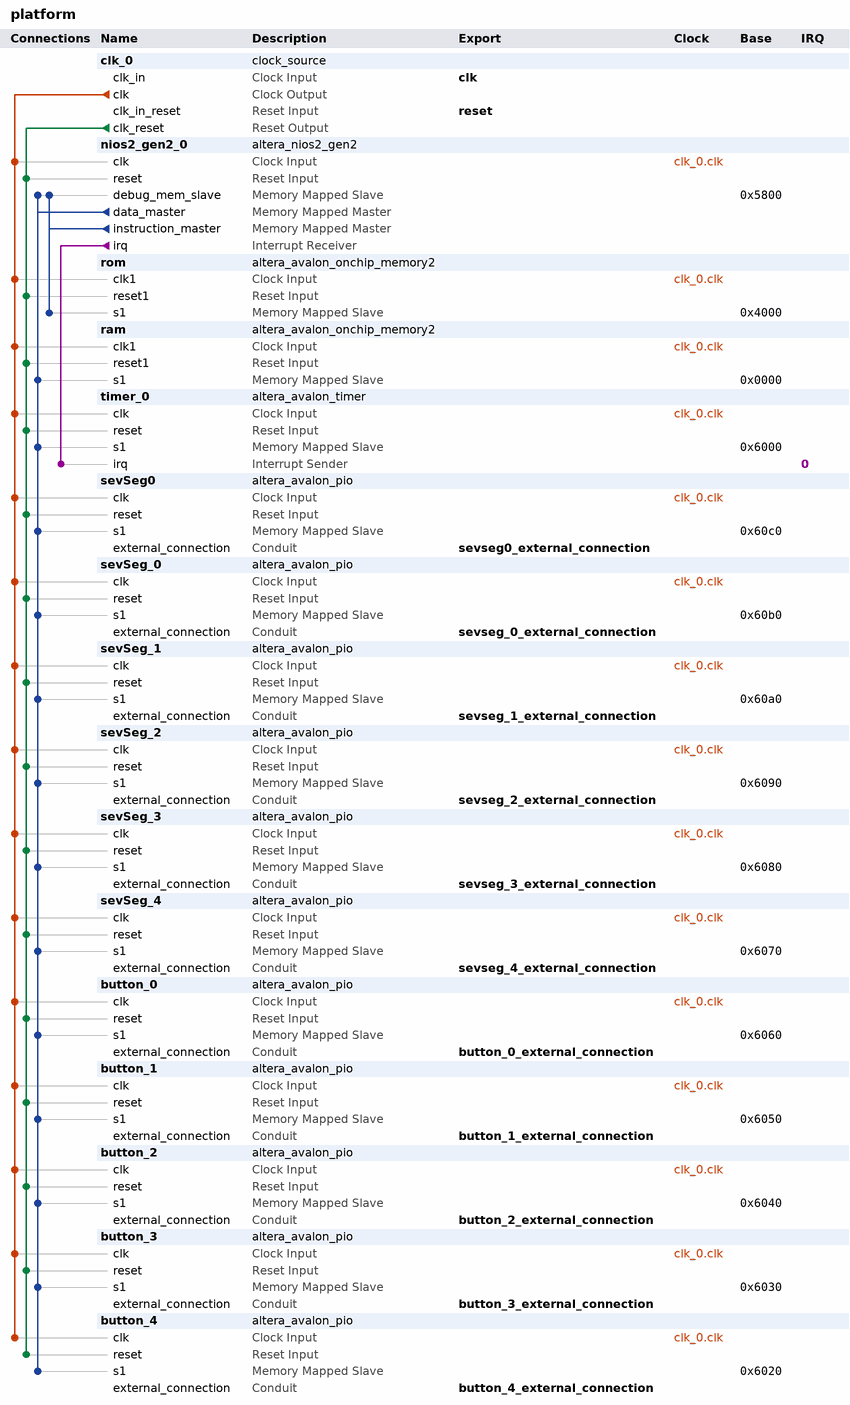
[diagram p0: system contents]
# Platform Designer (Qsys) system platform, Cyclone V 5CSEMA5F31C6
# Parameters at their usual value, and those the tool derives, are not listed.
package require -exact qsys 17.1
create_system platform
set_project_property DEVICE_FAMILY {Cyclone V}
set_project_property DEVICE 5CSEMA5F31C6

add_instance clk_0 clock_source 17.1
set_instance_parameter_value clk_0 clockFrequency 50000000

add_instance nios2_gen2_0 altera_nios2_gen2 17.1
set_instance_parameter_value nios2_gen2_0 dcache_size 2048
set_instance_parameter_value nios2_gen2_0 exceptionSlave rom.s1
set_instance_parameter_value nios2_gen2_0 icache_size 4096
set_instance_parameter_value nios2_gen2_0 impl Tiny
set_instance_parameter_value nios2_gen2_0 resetSlave rom.s1

add_instance rom altera_avalon_onchip_memory2 17.1
set_instance_parameter_value rom dataWidth 32
set_instance_parameter_value rom dualPort false
set_instance_parameter_value rom initMemContent true
set_instance_parameter_value rom initializationFileName onchip_mem.hex
set_instance_parameter_value rom memorySize 4096
set_instance_parameter_value rom writable false

add_instance ram altera_avalon_onchip_memory2 17.1
set_instance_parameter_value ram dataWidth 32
set_instance_parameter_value ram dualPort false
set_instance_parameter_value ram initMemContent true
set_instance_parameter_value ram initializationFileName onchip_mem.hex
set_instance_parameter_value ram memorySize 16384

add_instance timer_0 altera_avalon_timer 17.1
set_instance_parameter_value timer_0 alwaysRun true
set_instance_parameter_value timer_0 fixedPeriod true
set_instance_parameter_value timer_0 period 1
set_instance_parameter_value timer_0 periodUnits SEC
set_instance_parameter_value timer_0 snapshot false

add_instance sevSeg0 altera_avalon_pio 17.1
set_instance_parameter_value sevSeg0 direction Output
set_instance_parameter_value sevSeg0 width 7

add_instance sevSeg_0 altera_avalon_pio 17.1
set_instance_parameter_value sevSeg_0 direction Output
set_instance_parameter_value sevSeg_0 width 7

add_instance sevSeg_1 altera_avalon_pio 17.1
set_instance_parameter_value sevSeg_1 direction Output
set_instance_parameter_value sevSeg_1 width 7

add_instance sevSeg_2 altera_avalon_pio 17.1
set_instance_parameter_value sevSeg_2 direction Output
set_instance_parameter_value sevSeg_2 width 7

add_instance sevSeg_3 altera_avalon_pio 17.1
set_instance_parameter_value sevSeg_3 direction Output
set_instance_parameter_value sevSeg_3 width 7

add_instance sevSeg_4 altera_avalon_pio 17.1
set_instance_parameter_value sevSeg_4 direction Output
set_instance_parameter_value sevSeg_4 width 7

add_instance button_0 altera_avalon_pio 17.1
set_instance_parameter_value button_0 direction Input
set_instance_parameter_value button_0 width 1

add_instance button_1 altera_avalon_pio 17.1
set_instance_parameter_value button_1 direction Input
set_instance_parameter_value button_1 width 1

add_instance button_2 altera_avalon_pio 17.1
set_instance_parameter_value button_2 direction Input
set_instance_parameter_value button_2 width 1

add_instance button_3 altera_avalon_pio 17.1
set_instance_parameter_value button_3 direction Input
set_instance_parameter_value button_3 width 1

add_instance button_4 altera_avalon_pio 17.1
set_instance_parameter_value button_4 direction Input
set_instance_parameter_value button_4 width 1

# connections
add_connection clk_0.clk button_0.clk clock
add_connection clk_0.clk button_1.clk clock
add_connection clk_0.clk button_2.clk clock
add_connection clk_0.clk button_3.clk clock
add_connection clk_0.clk button_4.clk clock
add_connection clk_0.clk nios2_gen2_0.clk clock
add_connection clk_0.clk ram.clk1 clock
add_connection clk_0.clk rom.clk1 clock
add_connection clk_0.clk sevSeg0.clk clock
add_connection clk_0.clk sevSeg_0.clk clock
add_connection clk_0.clk sevSeg_1.clk clock
add_connection clk_0.clk sevSeg_2.clk clock
add_connection clk_0.clk sevSeg_3.clk clock
add_connection clk_0.clk sevSeg_4.clk clock
add_connection clk_0.clk timer_0.clk clock
add_connection clk_0.clk_reset button_0.reset reset
add_connection clk_0.clk_reset button_1.reset reset
add_connection clk_0.clk_reset button_2.reset reset
add_connection clk_0.clk_reset button_3.reset reset
add_connection clk_0.clk_reset button_4.reset reset
add_connection clk_0.clk_reset nios2_gen2_0.reset reset
add_connection clk_0.clk_reset ram.reset1 reset
add_connection clk_0.clk_reset rom.reset1 reset
add_connection clk_0.clk_reset sevSeg0.reset reset
add_connection clk_0.clk_reset sevSeg_0.reset reset
add_connection clk_0.clk_reset sevSeg_1.reset reset
add_connection clk_0.clk_reset sevSeg_2.reset reset
add_connection clk_0.clk_reset sevSeg_3.reset reset
add_connection clk_0.clk_reset sevSeg_4.reset reset
add_connection clk_0.clk_reset timer_0.reset reset
add_connection nios2_gen2_0.data_master button_0.s1 avalon
set_connection_parameter_value nios2_gen2_0.data_master/button_0.s1 baseAddress 0x6060
add_connection nios2_gen2_0.data_master button_1.s1 avalon
set_connection_parameter_value nios2_gen2_0.data_master/button_1.s1 baseAddress 0x6050
add_connection nios2_gen2_0.data_master button_2.s1 avalon
set_connection_parameter_value nios2_gen2_0.data_master/button_2.s1 baseAddress 0x6040
add_connection nios2_gen2_0.data_master button_3.s1 avalon
set_connection_parameter_value nios2_gen2_0.data_master/button_3.s1 baseAddress 0x6030
add_connection nios2_gen2_0.data_master button_4.s1 avalon
set_connection_parameter_value nios2_gen2_0.data_master/button_4.s1 baseAddress 0x6020
add_connection nios2_gen2_0.data_master nios2_gen2_0.debug_mem_slave avalon
set_connection_parameter_value nios2_gen2_0.data_master/nios2_gen2_0.debug_mem_slave baseAddress 0x5800
add_connection nios2_gen2_0.data_master ram.s1 avalon
set_connection_parameter_value nios2_gen2_0.data_master/ram.s1 baseAddress 0x0000
add_connection nios2_gen2_0.data_master sevSeg0.s1 avalon
set_connection_parameter_value nios2_gen2_0.data_master/sevSeg0.s1 baseAddress 0x60c0
add_connection nios2_gen2_0.data_master sevSeg_0.s1 avalon
set_connection_parameter_value nios2_gen2_0.data_master/sevSeg_0.s1 baseAddress 0x60b0
add_connection nios2_gen2_0.data_master sevSeg_1.s1 avalon
set_connection_parameter_value nios2_gen2_0.data_master/sevSeg_1.s1 baseAddress 0x60a0
add_connection nios2_gen2_0.data_master sevSeg_2.s1 avalon
set_connection_parameter_value nios2_gen2_0.data_master/sevSeg_2.s1 baseAddress 0x6090
add_connection nios2_gen2_0.data_master sevSeg_3.s1 avalon
set_connection_parameter_value nios2_gen2_0.data_master/sevSeg_3.s1 baseAddress 0x6080
add_connection nios2_gen2_0.data_master sevSeg_4.s1 avalon
set_connection_parameter_value nios2_gen2_0.data_master/sevSeg_4.s1 baseAddress 0x6070
add_connection nios2_gen2_0.data_master timer_0.s1 avalon
set_connection_parameter_value nios2_gen2_0.data_master/timer_0.s1 baseAddress 0x6000
add_connection nios2_gen2_0.instruction_master nios2_gen2_0.debug_mem_slave avalon
set_connection_parameter_value nios2_gen2_0.instruction_master/nios2_gen2_0.debug_mem_slave baseAddress 0x5800
add_connection nios2_gen2_0.instruction_master rom.s1 avalon
set_connection_parameter_value nios2_gen2_0.instruction_master/rom.s1 baseAddress 0x4000
add_connection nios2_gen2_0.irq timer_0.irq interrupt
set_connection_parameter_value nios2_gen2_0.irq/timer_0.irq irqNumber 0

# exported interfaces
add_interface button_0_external_connection conduit end
set_interface_property button_0_external_connection EXPORT_OF button_0.external_connection
add_interface button_1_external_connection conduit end
set_interface_property button_1_external_connection EXPORT_OF button_1.external_connection
add_interface button_2_external_connection conduit end
set_interface_property button_2_external_connection EXPORT_OF button_2.external_connection
add_interface button_3_external_connection conduit end
set_interface_property button_3_external_connection EXPORT_OF button_3.external_connection
add_interface button_4_external_connection conduit end
set_interface_property button_4_external_connection EXPORT_OF button_4.external_connection
add_interface clk clock sink
set_interface_property clk EXPORT_OF clk_0.clk_in
add_interface reset reset sink
set_interface_property reset EXPORT_OF clk_0.clk_in_reset
add_interface sevseg0_external_connection conduit end
set_interface_property sevseg0_external_connection EXPORT_OF sevSeg0.external_connection
add_interface sevseg_0_external_connection conduit end
set_interface_property sevseg_0_external_connection EXPORT_OF sevSeg_0.external_connection
add_interface sevseg_1_external_connection conduit end
set_interface_property sevseg_1_external_connection EXPORT_OF sevSeg_1.external_connection
add_interface sevseg_2_external_connection conduit end
set_interface_property sevseg_2_external_connection EXPORT_OF sevSeg_2.external_connection
add_interface sevseg_3_external_connection conduit end
set_interface_property sevseg_3_external_connection EXPORT_OF sevSeg_3.external_connection
add_interface sevseg_4_external_connection conduit end
set_interface_property sevseg_4_external_connection EXPORT_OF sevSeg_4.external_connection

set_interconnect_requirement {$system} qsys_mm.clockCrossingAdapter HANDSHAKE
set_interconnect_requirement {$system} qsys_mm.enableEccProtection FALSE
set_interconnect_requirement {$system} qsys_mm.insertDefaultSlave FALSE
set_interconnect_requirement {$system} qsys_mm.maxAdditionalLatency 1

save_system platform.qsys
